# Altium schematic sheet Sheet2.SchDoc
size B
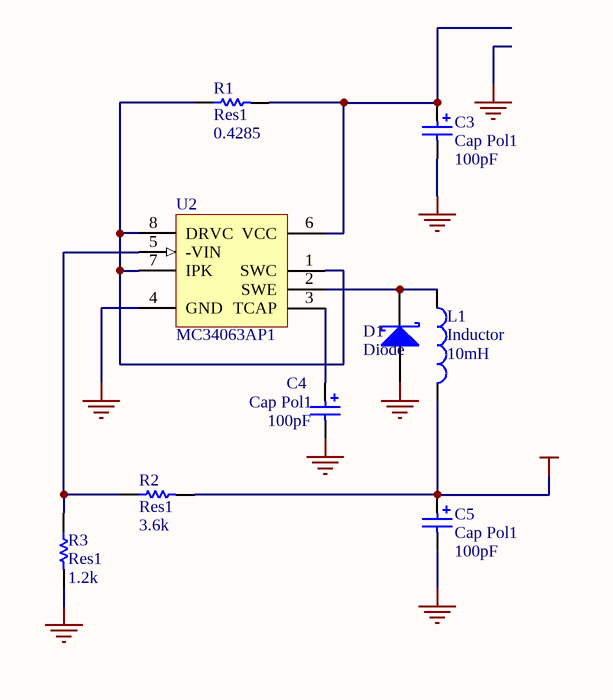
[diagram p0: Sheet2.SchDoc]

## Parts
C3  Cap Pol1  value 100pF  [RB7.6-15]
C4  Cap Pol1  value 100pF  [RB7.6-15]
C5  Cap Pol1  value 100pF  [RB7.6-15]
D1  Diode  [DSO-C2/X2.3]
L1  Inductor  value 10mH  [C1005-0402]
R1  Res1  value 0.4285  [AXIAL-0.3]
R2  Res1  value 3.6k  [AXIAL-0.3]
R3  Res1  value 1.2k  [AXIAL-0.3]
U2  MC34063AP1  [DIP-8]

## Nets
GND: C3.2 C4.2 C5.2 D1.1(A) R3.2 U2.4(GND)
VCC: C5.1 L1.2 R2.2
NetC3_1: C3.1 R1.2 U2.6(VCC)
NetC4_1: C4.1 U2.3(TCAP)
NetD1_2: D1.2(K) L1.1 U2.2(SWE)
NetR1_1: R1.1 U2.1(SWC) U2.7(IPK) U2.8(DRVC)
NetR2_1: R2.1 R3.1 U2.5(-VIN)

## Library data of the parts
C3-C5 = Cap Pol1: Polarized Capacitor (Radial); Manufacturer: Generic Components; Class I: Passive; Published: 8-Jun-2000; Revision: July-2002: Re-released for DXP Platform.; Publisher: Altium Limited; Class II: Capacitor
D1 = D Schottky: Schottky Diode; Manufacturer: Generic Components; Class I: Discrete; Class II: Diode - Schottky; Published: 8-Jun-2000; Revision: July-2002: Re-released for DXP Platform.; Publisher: Altium Limited
L1 = Inductor: Manufacturer: Generic Components; Class I: Passive; Published: 8-Jun-2000; Revision: July-2002: Re-released for DXP Platform.; Publisher: Altium Limited; Class II: Inductor
R1-R3 = Res1: Resistor; Manufacturer: Generic Components; Class I: Passive; Published: 8-Jun-2000; Revision: July-2002: Re-released for DXP Platform.; Publisher: Altium Limited; Class II: Resistor
U2 = MC34063AP1: DC-to-DC Converter Control Circuit; Manufacturer: Motorola; Class I: Power Management; Class II: DC-DC Converter; Published: 15-Apr-2002; Datasheet: Linear and Interface Integrated Circuits, DL128 Rev2 (1988); Package Reference: 626-05; Publisher: Altium Limited